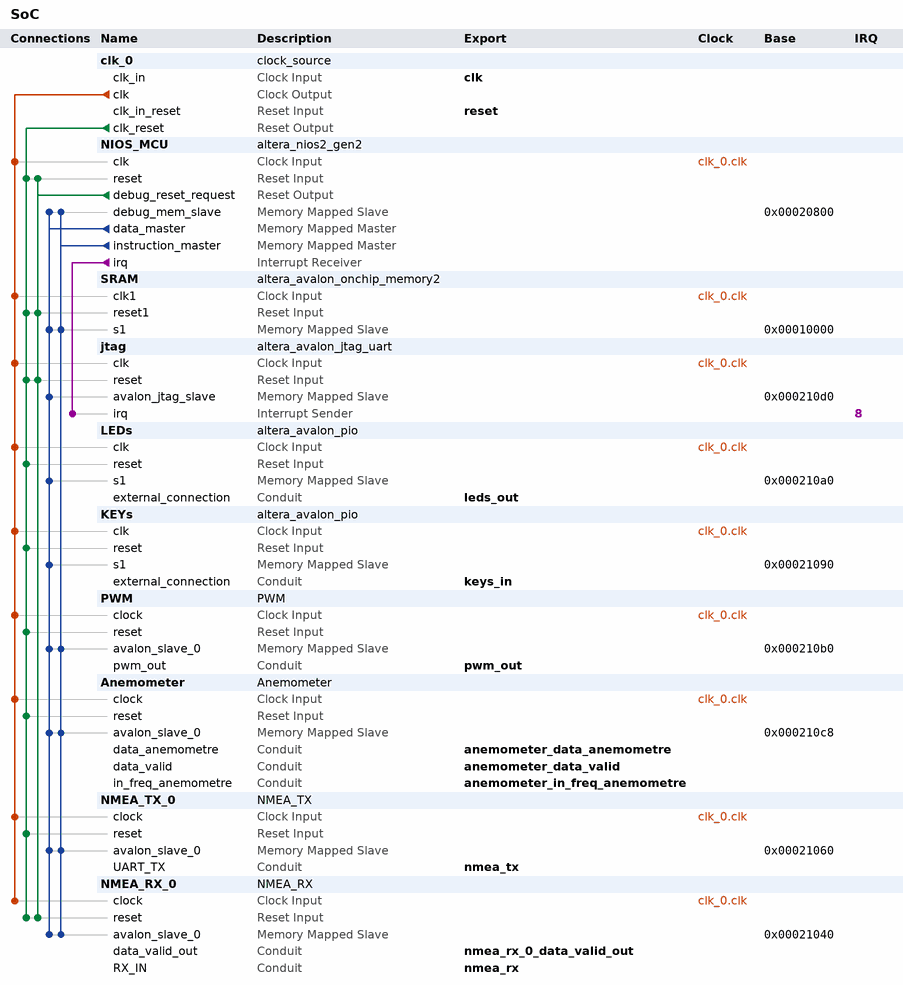
[diagram p0: system contents]
# Platform Designer (Qsys) system SoC, Cyclone IV E EP4CE22F17C6
# Parameters at their usual value, and those the tool derives, are not listed.
package require -exact qsys 18.1
create_system SoC
set_project_property DEVICE_FAMILY {Cyclone IV E}
set_project_property DEVICE EP4CE22F17C6

add_instance clk_0 clock_source 18.1
set_instance_parameter_value clk_0 clockFrequency 50000000

add_instance NIOS_MCU altera_nios2_gen2 18.1
set_instance_parameter_value NIOS_MCU dcache_size 2048
set_instance_parameter_value NIOS_MCU exceptionSlave SRAM.s1
set_instance_parameter_value NIOS_MCU icache_size 4096
set_instance_parameter_value NIOS_MCU impl Tiny
set_instance_parameter_value NIOS_MCU resetSlave SRAM.s1

add_instance SRAM altera_avalon_onchip_memory2 18.1
set_instance_parameter_value SRAM dataWidth 32
set_instance_parameter_value SRAM dualPort false
set_instance_parameter_value SRAM initMemContent true
set_instance_parameter_value SRAM initializationFileName onchip_mem.hex
set_instance_parameter_value SRAM memorySize 40960

add_instance jtag altera_avalon_jtag_uart 18.1
set_instance_parameter_value jtag simInteractiveOptions NO_INTERACTIVE_WINDOWS

add_instance LEDs altera_avalon_pio 18.1
set_instance_parameter_value LEDs direction Output
set_instance_parameter_value LEDs width 8

add_instance KEYs altera_avalon_pio 18.1
set_instance_parameter_value KEYs direction Input
set_instance_parameter_value KEYs width 2

add_instance PWM PWM 1.0
set_instance_parameter_value PWM duty_bus 16
set_instance_parameter_value PWM freq_bus 16

add_instance Anemometer Anemometer 1.0

add_instance NMEA_TX_0 NMEA_TX 1.0

add_instance NMEA_RX_0 NMEA_RX 1.2

# connections
add_connection clk_0.clk Anemometer.clock clock
add_connection clk_0.clk jtag.clk clock
add_connection clk_0.clk KEYs.clk clock
add_connection clk_0.clk LEDs.clk clock
add_connection clk_0.clk NIOS_MCU.clk clock
add_connection clk_0.clk NMEA_RX_0.clock clock
add_connection clk_0.clk NMEA_TX_0.clock clock
add_connection clk_0.clk PWM.clock clock
add_connection clk_0.clk SRAM.clk1 clock
add_connection clk_0.clk_reset Anemometer.reset reset
add_connection clk_0.clk_reset jtag.reset reset
add_connection clk_0.clk_reset KEYs.reset reset
add_connection clk_0.clk_reset LEDs.reset reset
add_connection clk_0.clk_reset NIOS_MCU.reset reset
add_connection clk_0.clk_reset NMEA_RX_0.reset reset
add_connection clk_0.clk_reset NMEA_TX_0.reset reset
add_connection clk_0.clk_reset PWM.reset reset
add_connection clk_0.clk_reset SRAM.reset1 reset
add_connection NIOS_MCU.debug_reset_request jtag.reset reset
add_connection NIOS_MCU.debug_reset_request NIOS_MCU.reset reset
add_connection NIOS_MCU.debug_reset_request NMEA_RX_0.reset reset
add_connection NIOS_MCU.debug_reset_request SRAM.reset1 reset
add_connection NIOS_MCU.data_master Anemometer.avalon_slave_0 avalon
set_connection_parameter_value NIOS_MCU.data_master/Anemometer.avalon_slave_0 baseAddress 0x000210c8
add_connection NIOS_MCU.data_master jtag.avalon_jtag_slave avalon
set_connection_parameter_value NIOS_MCU.data_master/jtag.avalon_jtag_slave baseAddress 0x000210d0
add_connection NIOS_MCU.data_master KEYs.s1 avalon
set_connection_parameter_value NIOS_MCU.data_master/KEYs.s1 baseAddress 0x00021090
add_connection NIOS_MCU.data_master LEDs.s1 avalon
set_connection_parameter_value NIOS_MCU.data_master/LEDs.s1 baseAddress 0x000210a0
add_connection NIOS_MCU.data_master NIOS_MCU.debug_mem_slave avalon
set_connection_parameter_value NIOS_MCU.data_master/NIOS_MCU.debug_mem_slave baseAddress 0x00020800
add_connection NIOS_MCU.data_master NMEA_RX_0.avalon_slave_0 avalon
set_connection_parameter_value NIOS_MCU.data_master/NMEA_RX_0.avalon_slave_0 baseAddress 0x00021040
add_connection NIOS_MCU.data_master NMEA_TX_0.avalon_slave_0 avalon
set_connection_parameter_value NIOS_MCU.data_master/NMEA_TX_0.avalon_slave_0 baseAddress 0x00021060
add_connection NIOS_MCU.data_master PWM.avalon_slave_0 avalon
set_connection_parameter_value NIOS_MCU.data_master/PWM.avalon_slave_0 baseAddress 0x000210b0
add_connection NIOS_MCU.data_master SRAM.s1 avalon
set_connection_parameter_value NIOS_MCU.data_master/SRAM.s1 baseAddress 0x00010000
add_connection NIOS_MCU.instruction_master Anemometer.avalon_slave_0 avalon
set_connection_parameter_value NIOS_MCU.instruction_master/Anemometer.avalon_slave_0 baseAddress 0x000210c8
add_connection NIOS_MCU.instruction_master NIOS_MCU.debug_mem_slave avalon
set_connection_parameter_value NIOS_MCU.instruction_master/NIOS_MCU.debug_mem_slave baseAddress 0x00020800
add_connection NIOS_MCU.instruction_master NMEA_RX_0.avalon_slave_0 avalon
set_connection_parameter_value NIOS_MCU.instruction_master/NMEA_RX_0.avalon_slave_0 baseAddress 0x00021040
add_connection NIOS_MCU.instruction_master NMEA_TX_0.avalon_slave_0 avalon
set_connection_parameter_value NIOS_MCU.instruction_master/NMEA_TX_0.avalon_slave_0 baseAddress 0x00021060
add_connection NIOS_MCU.instruction_master PWM.avalon_slave_0 avalon
set_connection_parameter_value NIOS_MCU.instruction_master/PWM.avalon_slave_0 baseAddress 0x000210b0
add_connection NIOS_MCU.instruction_master SRAM.s1 avalon
set_connection_parameter_value NIOS_MCU.instruction_master/SRAM.s1 baseAddress 0x00010000
add_connection NIOS_MCU.irq jtag.irq interrupt
set_connection_parameter_value NIOS_MCU.irq/jtag.irq irqNumber 8

# exported interfaces
add_interface anemometer_data_anemometre conduit end
set_interface_property anemometer_data_anemometre EXPORT_OF Anemometer.data_anemometre
add_interface anemometer_data_valid conduit end
set_interface_property anemometer_data_valid EXPORT_OF Anemometer.data_valid
add_interface anemometer_in_freq_anemometre conduit end
set_interface_property anemometer_in_freq_anemometre EXPORT_OF Anemometer.in_freq_anemometre
add_interface clk clock sink
set_interface_property clk EXPORT_OF clk_0.clk_in
add_interface keys_in conduit end
set_interface_property keys_in EXPORT_OF KEYs.external_connection
add_interface leds_out conduit end
set_interface_property leds_out EXPORT_OF LEDs.external_connection
add_interface nmea_rx conduit end
set_interface_property nmea_rx EXPORT_OF NMEA_RX_0.RX_IN
add_interface nmea_rx_0_data_valid_out conduit end
set_interface_property nmea_rx_0_data_valid_out EXPORT_OF NMEA_RX_0.data_valid_out
add_interface nmea_tx conduit end
set_interface_property nmea_tx EXPORT_OF NMEA_TX_0.UART_TX
add_interface pwm_out conduit end
set_interface_property pwm_out EXPORT_OF PWM.pwm_out
add_interface reset reset sink
set_interface_property reset EXPORT_OF clk_0.clk_in_reset

set_interconnect_requirement {$system} qsys_mm.clockCrossingAdapter HANDSHAKE
set_interconnect_requirement {$system} qsys_mm.enableEccProtection FALSE
set_interconnect_requirement {$system} qsys_mm.insertDefaultSlave FALSE
set_interconnect_requirement {$system} qsys_mm.maxAdditionalLatency 1

save_system SoC.qsys
